# EAGLE schematic Pro-Micro-v11 (EAGLE 6.5.0)
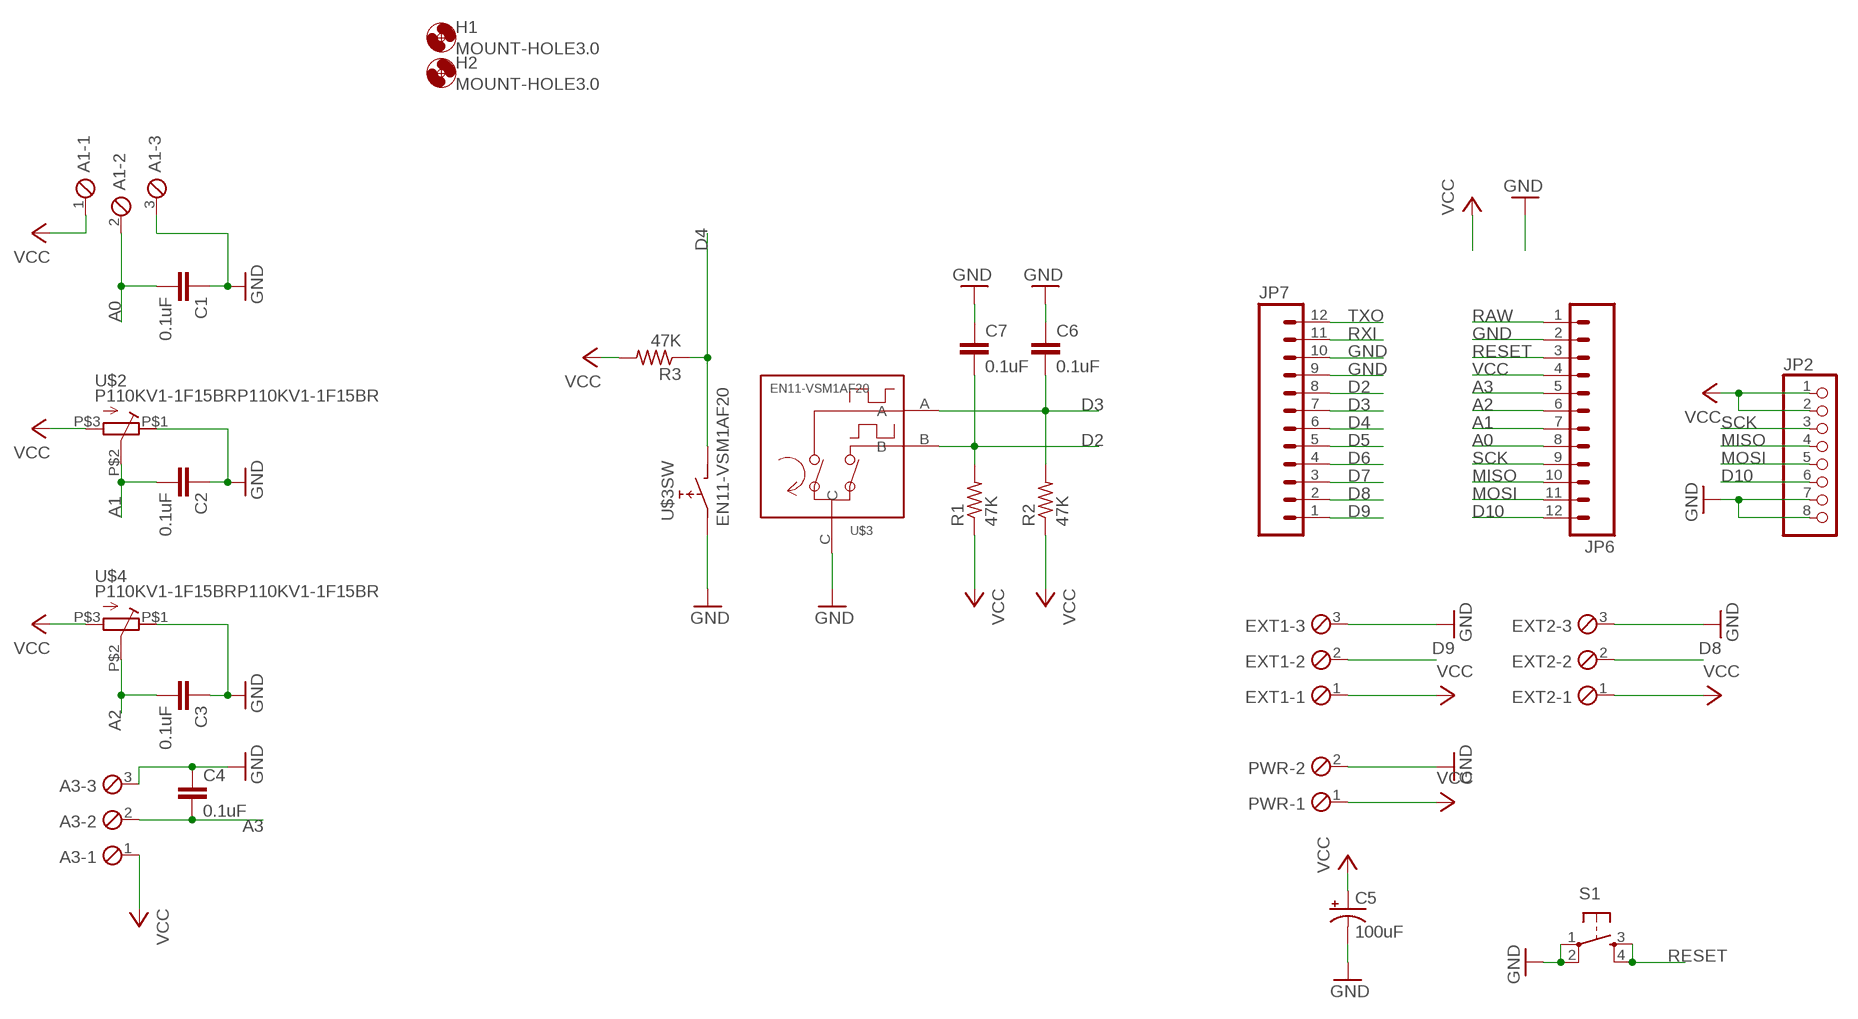
[diagram p0: schematic, sheet 1]

## Parts
A1  MPT3  [3POL254]
A3  MPT3  [3POL254]
C1  0.1uF  C-EU025-025X050  [C025-025X050]
C2  0.1uF  C-EU025-025X050  [C025-025X050]
C3  0.1uF  C-EU025-025X050  [C025-025X050]
C4  0.1uF  C-EU025-025X050  [C025-025X050]
C5  100uF  CPOL-USE3.5-8  [E3,5-8]
C6  0.1uF  C-EU025-024X044  [C025-024X044]
C7  0.1uF  C-EU025-024X044  [C025-024X044]
EXT1  MPT3  [3POL254]
EXT2  MPT3  [3POL254]
H1  MOUNT-HOLE3.0  [3,0]
H2  MOUNT-HOLE3.0  [3,0]
JP2  HEADER-1X8  [1X08_OVAL]
JP6  M12PTH  [1X12]
JP7  M12PTH  [1X12]
PWR  MPT2  [2POL254]
R1  47K  R-US_0204/5  [0204/5]
R2  47K  R-US_0204/5  [0204/5]
R3  47K  R-US_0204/5  [0204/5]
S1  TAC_SWITCHPTH  [TACTILE-PTH]
U$2  P110KV1-1F15BRP110KV1-1F15BR  [P110KV1-1F15BR]
U$3  EN11-VSM1AF20  EN11  [EN11-VS*]
U$4  P110KV1-1F15BRP110KV1-1F15BR  [P110KV1-1F15BR]

## Nets
A0: A1.2 C1.2 JP6.8
A1: C2.2 JP6.7 U$2.P$2(S)
A2: C3.2 JP6.6 U$4.P$2(S)
A3: A3.2 C4.2 JP6.5
D2: C7.2 JP7.8 R1.2 U$3.B
D3: C6.2 JP7.7 R2.2 U$3.A
D4: JP7.6 R3.1 U$3.E
D5: JP7.5
D6: JP7.4
D7: JP7.3
D8: EXT2.2 JP7.2
D9: EXT1.2 JP7.1
D10: JP2.6 JP6.12
GND [vcc]: A1.3 A3.3 C1.1 C2.1 C3.1 C4.1 C5.- C6.1 C7.1 EXT1.3 EXT2.3 JP2.7 JP2.8 JP6.2 JP7.9 JP7.10 PWR.2 S1.1 S1.2 U$2.P$1(A) U$3.C U$3.D U$4.P$1(A)
MISO: JP2.4 JP6.10
MOSI: JP2.5 JP6.11
RAW [vcc]: JP6.1
RESET: JP6.3 S1.3 S1.4
RXI: JP7.11
SCK: JP2.3 JP6.9
TXO: JP7.12
VCC: A1.1 A3.1 C5.+ EXT1.1 EXT2.1 JP2.1 JP2.2 JP6.4 PWR.1 R1.1 R2.1 R3.2 U$2.P$3(E) U$4.P$3(E)

## Library data of the parts
A1 A3 EXT1 EXT2 = con-phoenix-254:MPT3: PHOENIX CONNECTOR; OC_FARNELL: unknown; OC_NEWARK: unknown
C1-C4 C6 C7 = rcl:C-EU: CAPACITOR, European symbol
C5 = rcl:CPOL-US: POLARIZED CAPACITOR, American symbol
H1 H2 = holes:MOUNT-HOLE: MOUNTING HOLE with drill center marker
JP2 = microbuilder:HEADER-1X8: PIN HEADER
JP6 JP7 = SparkFun:M12: Header 12 Standard 12-pin 0.1" header. Use with straight break away headers (SKU : PRT-00116), right angle break away headers (PRT-00553), swiss pins (PRT-00743), machine pins (PRT-00117), and female headers (PRT-00115).
PWR = con-phoenix-254:MPT2: PHOENIX CONNECTOR; OC_FARNELL: unknown; OC_NEWARK: unknown
R1-R3 = rcl:R-US_: RESISTOR, American symbol
S1 = SparkFun-Electromechanical:TAC_SWITCH: Momentary Switch Button commonly used for reset or general input. Spark Fun Electronics SKU : COM-00097 SMT- SWCH-08247
U$2 U$4 = keves:P110KV1-1F15BR
U$3 = rotary-encoder:EN11

## Net classes
0 default: width 0.254 mm
1 vcc: width 0.635 mm